# Altium schematic sheet schematic.SchDoc
size A4
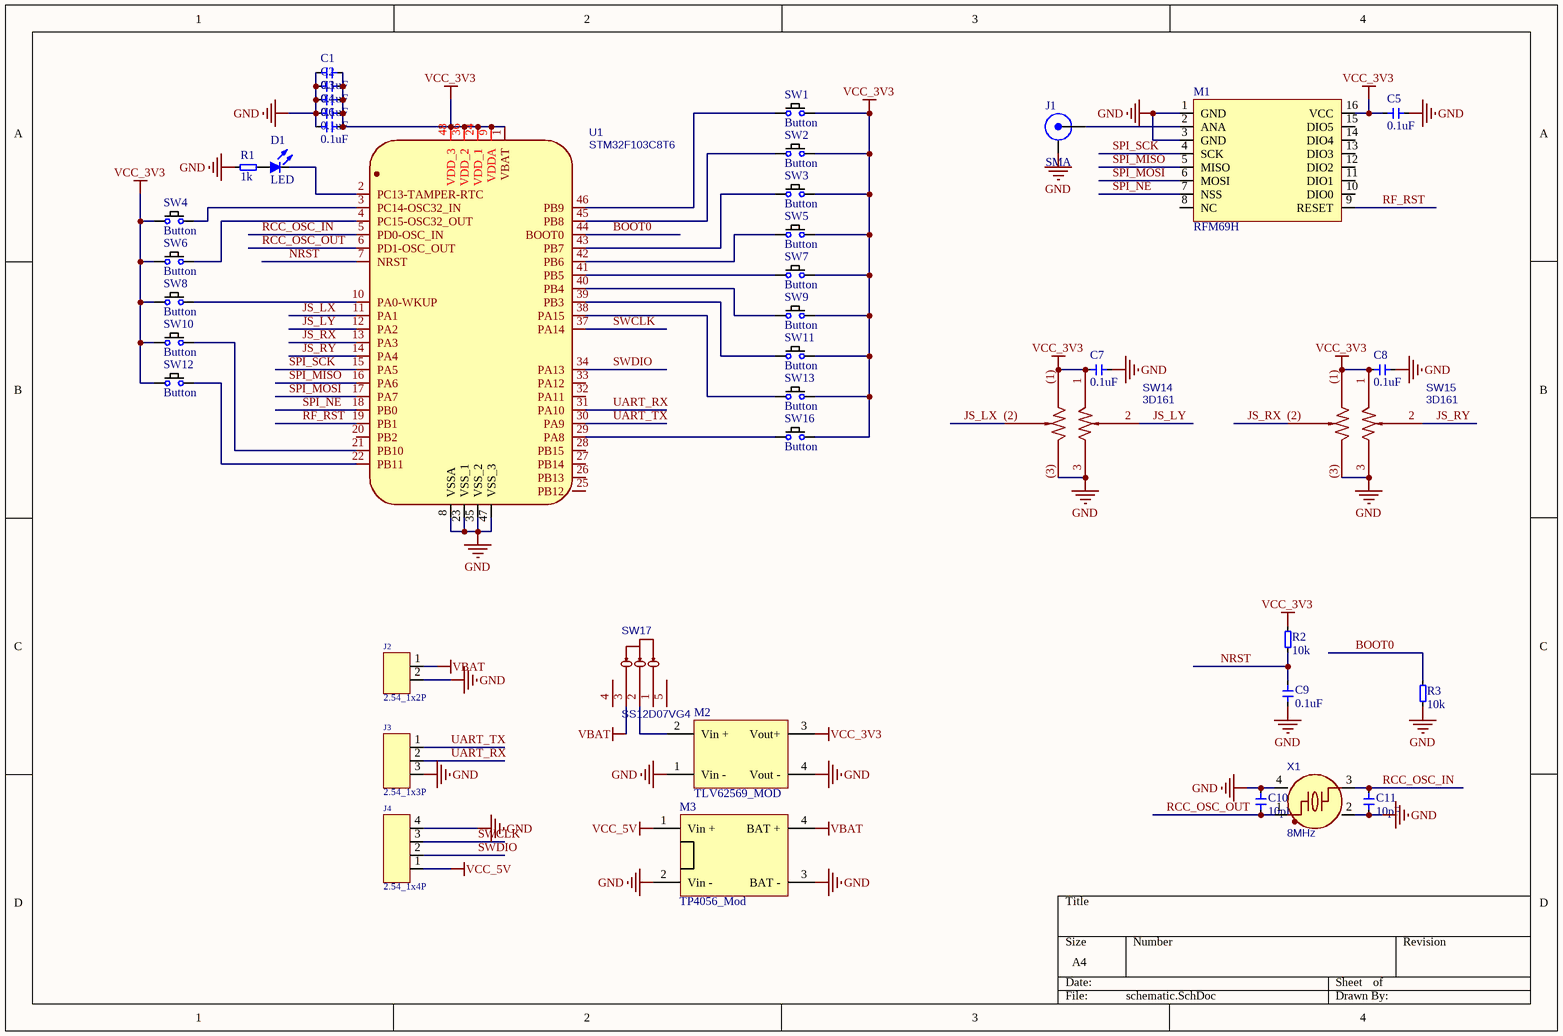
[diagram p0: schematic.SchDoc]

## Parts
C1  0.1uF  [0402]
C2  0.1uF  [0402]
C3  0.1uF  [0402]
C4  0.1uF  [0402]
C5  0.1uF  [0402]
C6  0.1uF  [0402]
C7  0.1uF  [0402]
C8  0.1uF  [0402]
C9  0.1uF  [0402]
C10  10pF  [0402]
C11  10pF  [0402]
D1  LED  [0603LED]
J1  SMA  [SMA_Edge]
J2  2.54_1x2P  [2.54排针_1x2立式]
J3  2.54_1x3P  [2.54排针_1x3立式]
J4  2.54_1x4P  [2.54排针_1x4立式]
M1  RFM69H  [RFM69H]
M2  TLV62569_MOD  [DM13]
M3  TP4056_Mod  [TP4056_Mod_1]
R1  1k  [0402]
R2  10k  [0402]
R3  10k  [0402]
SW1  Button  [KEY-SMD_4P-L6.0-W6.0-P4.50-LS8.6]
SW2  Button  [KEY-SMD_4P-L6.0-W6.0-P4.50-LS8.6]
SW3  Button  [KEY-SMD_4P-L6.0-W6.0-P4.50-LS8.6]
SW4  Button  [KEY-SMD_4P-L6.0-W6.0-P4.50-LS8.6]
SW5  Button  [KEY-SMD_4P-L6.0-W6.0-P4.50-LS8.6]
SW6  Button  [KEY-SMD_4P-L6.0-W6.0-P4.50-LS8.6]
SW7  Button  [KEY-SMD_4P-L6.0-W6.0-P4.50-LS8.6]
SW8  Button  [KEY-SMD_4P-L6.0-W6.0-P4.50-LS8.6]
SW9  Button  [KEY-SMD_4P-L6.0-W6.0-P4.50-LS8.6]
SW10  Button  [KEY-SMD_4P-L6.0-W6.0-P4.50-LS8.6]
SW11  Button  [KEY-SMD_4P-L6.0-W6.0-P4.50-LS8.6]
SW12  Button  [KEY-SMD_4P-L6.0-W6.0-P4.50-LS8.6]
SW13  Button  [KEY-SMD_4P-L6.0-W6.0-P4.50-LS8.6]
SW14  3D161  [SW-TH_3D161]
SW15  3D161  [SW-TH_3D161]
SW16  Button  [KEY-SMD_4P-L6.0-W6.0-P4.50-LS8.6]
SW17  SS12D07VG4  [SW-TH_SS12D07VG4]
U1  STM32F103C8T6  [LQFP-48_L7.0-W7.0-P0.50-LS9.0-BL]
X1  8MHz  [OSC-SMD_4P-L3.2-W2.5-BL]

## Nets
GND: C1.2 C2.2 C3.2 C4.2 C5.2 C6.2 C7.2 C8.2 C9.1 C10.2 C11.1 J1.2 J2.2 J3.3 J4.4 M1.1(GND) M1.3(GND) M2.1(Vin_-) M2.4(Vout_-) M3.2(Vin_-) M3.3(BAT_-) R1.1 R3.1 SW14.3 SW14.(3) SW15.3 SW15.(3) U1.8(VSSA) U1.23(VSS_1) U1.35(VSS_2) U1.47(VSS_3) X1.2(GND) X1.4(GND)
VBAT: J2.1 M3.4(BAT_+) SW17.3
VCC_3V3: C1.1 C2.1 C3.1 C4.1 C5.1 C6.1 C7.1 C8.1 M1.16(VCC) M2.3(Vout+) R2.2 SW1.2 SW2.2 SW3.2 SW4.1 SW5.2 SW6.1 SW7.2 SW8.1 SW9.2 SW10.1 SW11.2 SW12.1 SW13.2 SW14.1 SW14.(1) SW15.1 SW15.(1) SW16.2 U1.1(VBAT) U1.9(VDDA) U1.24(VDD_1) U1.36(VDD_2) U1.48(VDD_3)
VCC_5V: J4.1 M3.1(Vin_+)
BOOT0: R3.2 U1.44(BOOT0)
JS_LX: SW14.(2) U1.11(PA1)
JS_LY: SW14.2 U1.12(PA2)
JS_RX: SW15.(2) U1.13(PA3)
JS_RY: SW15.2 U1.14(PA4)
NRST: C9.2 R2.1 U1.7(NRST)
RCC_OSC_IN: C11.2 U1.5(PD0-OSC_IN) X1.3
RCC_OSC_OUT: C10.1 U1.6(PD1-OSC_OUT) X1.1
RF_RST: M1.9(RESET) U1.19(PB1)
SPI_MISO: M1.5(MISO) U1.16(PA6)
SPI_MOSI: M1.6(MOSI) U1.17(PA7)
SPI_NE: M1.7(NSS) U1.18(PB0)
SPI_SCK: M1.4(SCK) U1.15(PA5)
SWCLK: J4.3 U1.37(PA14)
SWDIO: J4.2 U1.34(PA13)
UART_RX: J3.2 U1.31(PA10)
UART_TX: J3.1 U1.30(PA9)
NetD1_A: D1.A R1.2
NetD1_K: D1.K U1.2(PC13-TAMPER-RTC)
NetJ1_1: J1.1 M1.2(ANA)
NetM2_2: M2.2(Vin_+) SW17.2
NetSW1_1: SW1.1 U1.46(PB9)
NetSW2_1: SW2.1 U1.45(PB8)
NetSW3_1: SW3.1 U1.43(PB7)
NetSW4_2: SW4.2 U1.3(PC14-OSC32_IN)
NetSW5_1: SW5.1 U1.42(PB6)
NetSW6_2: SW6.2 U1.4(PC15-OSC32_OUT)
NetSW7_1: SW7.1 U1.41(PB5)
NetSW8_2: SW8.2 U1.10(PA0-WKUP)
NetSW9_1: SW9.1 U1.40(PB4)
NetSW10_2: SW10.2 U1.21(PB10)
NetSW11_1: SW11.1 U1.39(PB3)
NetSW12_2: SW12.2 U1.22(PB11)
NetSW13_1: SW13.1 U1.38(PA15)
NetSW16_1: SW16.1 U1.29(PA8)

Not connected (* = marked no-connect by the designer): M1 8(NC) 10(DIO0) 11(DIO1) 12(DIO2) 13(DIO3) 14(DIO4) 15(DIO5); SW17 1 4 5; U1 20(PB2) 25(PB12) 26(PB13) 27(PB14) 28(PB15) 32(PA11) 33(PA12)

## Library data of the parts
C1-C11 = Cap
J1 = Coax
M2 = DM13
R1-R3 = Res: Resistor
SW14 SW15 = 3D161: BOM_Manufacturer: HRO; Contributor: LCSC; BOM_Supplier: LCSC; BOM_Manufacturer Part: 3D161; BOM_Supplier Part: C92593; BOM_JLCPCB Part Class: Extended Part; spicePre: S; spiceSymbolName: 3D161
SW17 = SS12D07VG4: BOM_Manufacturer: SHOU HAN; Contributor: LCSC; BOM_Supplier: LCSC; BOM_Supplier Part: C431546; BOM_Manufacturer Part: SS12D07VG4; spicePre: S; spiceSymbolName: SS12D07VG4
U1 = STM32F103C8T6: BOM_Manufacturer: STMicroelectronics; timeStamp: 1455028086; BOM_Supplier: LCSC; BOM_Manufacturer Part: STM32F103C8T6; BOM_Supplier Part: C8734; BOM_JLCPCB Part Class: Basic Part; spicePre: U; spiceSymbolName: STM32F103C8T6
X1 = Crystal_4P: BOM_Manufacturer: Suzhou Liming Elec; BOM_Manufacturer Part: 3225-8.00-20-10-10/A; nameAlias: Frequency; Contributor: LCSC; BOM_Supplier: LCSC; BOM_Supplier Part: C518156; spicePre: X; spiceSymbolName: 3225-8.00-20-10-10/A